# Altium project SSST.PrjPcb
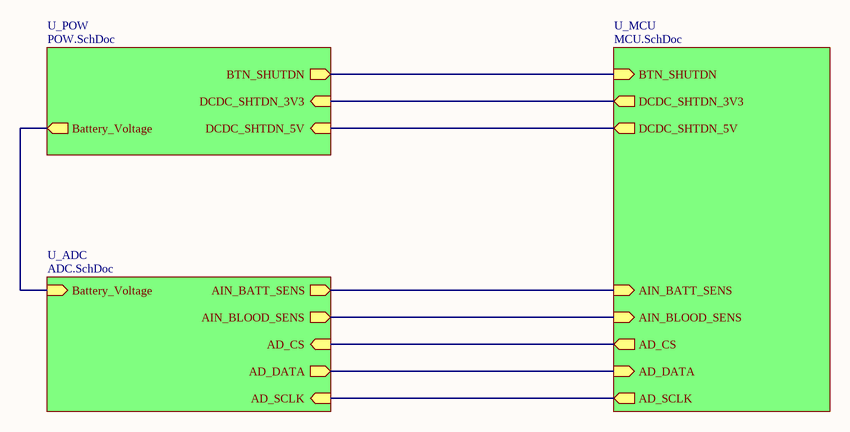
[diagram p0: TOP.SchDoc]
4 sheets, 72 parts. Net scope: hierarchical (ports join the sheet entries above them; power ports are global).
Board files: 4Layer_Imposition.PcbDoc, 4Layer.PcbDoc
Sheets:
  TOP.SchDoc
    U_ADC = ADC.SchDoc
    U_MCU = MCU.SchDoc
    U_POW = POW.SchDoc

## Sheet TOP.SchDoc
size A4; DocumentNumber: 1; SheetNumber: 1; SheetTotal: 4

### Sub-sheets
U_ADC = ADC.SchDoc: AIN_BLOOD_SENS (out), AD_CS (in), AD_DATA (out), AD_SCLK (in), Battery_Voltage (in), AIN_BATT_SENS (out)
U_MCU = MCU.SchDoc: BTN_SHUTDN (in), AIN_BLOOD_SENS (in), AD_CS (out), AD_DATA (in), AD_SCLK (out), DCDC_SHTDN_3V3 (out), DCDC_SHTDN_5V (out), AIN_BATT_SENS (in)
U_POW = POW.SchDoc: DCDC_SHTDN_3V3 (in), DCDC_SHTDN_5V (in), BTN_SHUTDN (out), Battery_Voltage (out)

### Nets
AIN_BLOOD_SENS: sheet U_ADC/AIN_BLOOD_SENS, sheet U_MCU/AIN_BLOOD_SENS
NetC2_2: sheet U_MCU/BTN_SHUTDN, sheet U_POW/BTN_SHUTDN
NetC7_2: sheet U_ADC/Battery_Voltage, sheet U_POW/Battery_Voltage
NetD1_A: sheet U_MCU/DCDC_SHTDN_3V3, sheet U_POW/DCDC_SHTDN_3V3
NetR6_2: sheet U_MCU/DCDC_SHTDN_5V, sheet U_POW/DCDC_SHTDN_5V
NetU4_16: sheet U_ADC/AIN_BATT_SENS, sheet U_MCU/AIN_BATT_SENS
NetU4_50: sheet U_ADC/AD_DATA, sheet U_MCU/AD_DATA
NetU4_51: sheet U_ADC/AD_CS, sheet U_MCU/AD_CS
NetU4_52: sheet U_ADC/AD_SCLK, sheet U_MCU/AD_SCLK

### Notes on the sheet
- Project Title:
- Project No:
- Size:
- Date:
- A4
- Rev:
- Page Title:
- Sheet:
- of

## Sheet ADC.SchDoc
size A4; DocumentNumber: 3; SheetNumber: 3; SheetTotal: 4
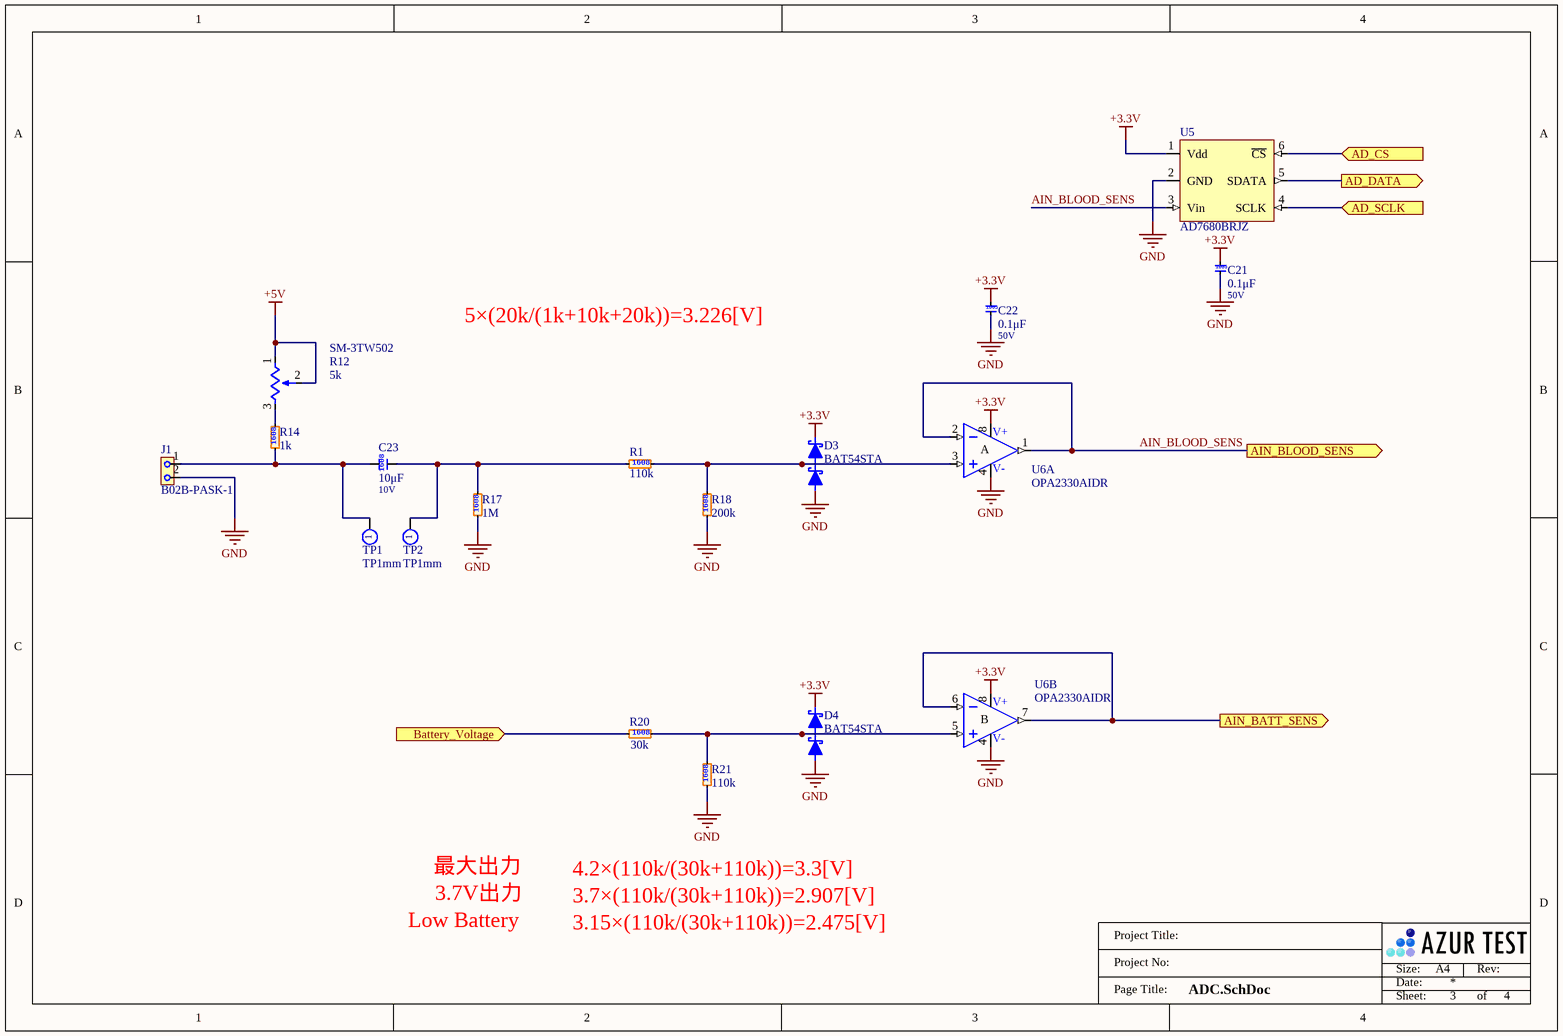
[diagram p1: ADC.SchDoc]

### Parts
C21  Tag: 0.1μF  Voltage: 50V  [C1005]  (hidden comment: GRM1552C1H101J)
C22  Tag: 0.1μF  Voltage: 50V  [C1005]  (hidden comment: GRM1552C1H101J)
C23  Tag: 10μF  Voltage: 10V  [C1608]  (hidden comment: C1608X5R1A106M080AC)
D3  BAT54STA  [SOT-23]
D4  BAT54STA  [SOT-23]
J1  B02B-PASK-1  [B02B-PASK-1]
R1  Tag: 110k  [R1608]  (hidden comment: RG1608P-114-B-T5)
R12  SM-3TW502  Tag: 5k  [SM-3TW]
R14  Tag: 1k  [R1608]  (hidden comment: RG1608P-102-B-T5)
R17  Tag: 1M  [R1608]  (hidden comment: RT0603DRD071ML)
R18  Tag: 200k  [R1608]  (hidden comment: RG1608P-204-B-T5)
R20  Tag: 30k  [R1608]  (hidden comment: RG1608P-303-B-T5)
R21  Tag: 110k  [R1608]  (hidden comment: RG1608P-114-B-T5)
TP1  TP1mm  [TP1mm]  (no BOM)
TP2  TP1mm  [TP1mm]  (no BOM)
U5  AD7680BRJZ  [SOT-23-6]
U6  OPA2330AIDR  [SOIC8_3.9mm]  (parts A,B of 2)

### Ports
AD_CS (in), AD_DATA (out), AD_SCLK (in), AIN_BATT_SENS (out), AIN_BLOOD_SENS (out), Battery_Voltage (in)

### Nets
+3.3V: C21.2 C22.2 D3.2(K) D4.2(K) U5.1(Vdd) U6.8(V+)
+5V: R12.1 R12.2
GND: C21.1 C22.1 D3.1(A) D4.1(A) J1.2 R17.1 R18.1 R21.1 U5.2(GND) U6.4(V-)
AIN_BLOOD_SENS: U5.3(Vin) U6.1(OUT) U6.2(IN-) ; port AIN_BLOOD_SENS
NetC7_2: R20.1 ; port Battery_Voltage
NetC23_1: C23.1 R1.1 R17.2 TP2.1
NetC23_2: C23.2 J1.1 R14.1 TP1.1
NetD3_3: D3.3(C) R1.2 R18.2 U6.3(IN+)
NetD4_3: D4.3(C) R20.2 R21.2 U6.5(IN+)
NetR12_3: R12.3 R14.2
NetU4_16: U6.6(IN-) U6.7(OUT) ; port AIN_BATT_SENS
NetU4_50: U5.5(SDATA) ; port AD_DATA
NetU4_51: U5.6(~{CS}) ; port AD_CS
NetU4_52: U5.4(SCLK) ; port AD_SCLK

### Notes on the sheet
- 5×(20k/(1k+10k+20k))=3.226[V]
- 最大出力
- 3.7V出力
- 4.2×(110k/(30k+110k))=3.3[V]
- 3.7×(110k/(30k+110k))=2.907[V]
- Low Battery
- 3.15×(110k/(30k+110k))=2.475[V]
- Project Title:
- Project No:
- Size:
- Date:
- A4
- Rev:
- Page Title:
- Sheet:
- of
- (in symbol C1005) 1005
- (in symbol C1608) 1608
- (in symbol MF1608) 1608
- (in symbol OPA2330AIDR, part A) A
- (in symbol OPA2330AIDR, part B) B

### Library data of the parts
C21 C22 = C1005: セラコン1005サイズ; Vendor: murata
C23 = C1608: セラコン1608サイズ; Vendor: TDK Corporation
D3 D4 = BAT54S: ダブル直列ショットキー; Vendor: Fairchild
J1 = B02B-PASK-1: 雄,ストレート,1列2ピン; Vendor: JST
R1 R14 R18 R20 R21 = MF1608: 薄膜チップ抵抗1608サイズ; Vendor: susumu
R12 = SM-3TW***: CERMET TRIMMER 11 turns Top adjustmet; Vendor: Copal
R17 = MF1608: 薄膜チップ抵抗1608サイズ; Vendor: Yageo
TP1 TP2 = TP1mm: Test-Point 1mm
U5 = AD7680BRJZ: 16bit ADC 2.5V～5.5V SOT23; Vender: Analog Devices
U6 = OPA2330AIDR: CMOS ゼロドリフトアンプ 2回路 レールツーレール 8SOIC; Vendor: Texas Instruments

## Sheet MCU.SchDoc
size A4; DocumentNumber: 4; SheetNumber: 4; SheetTotal: 4
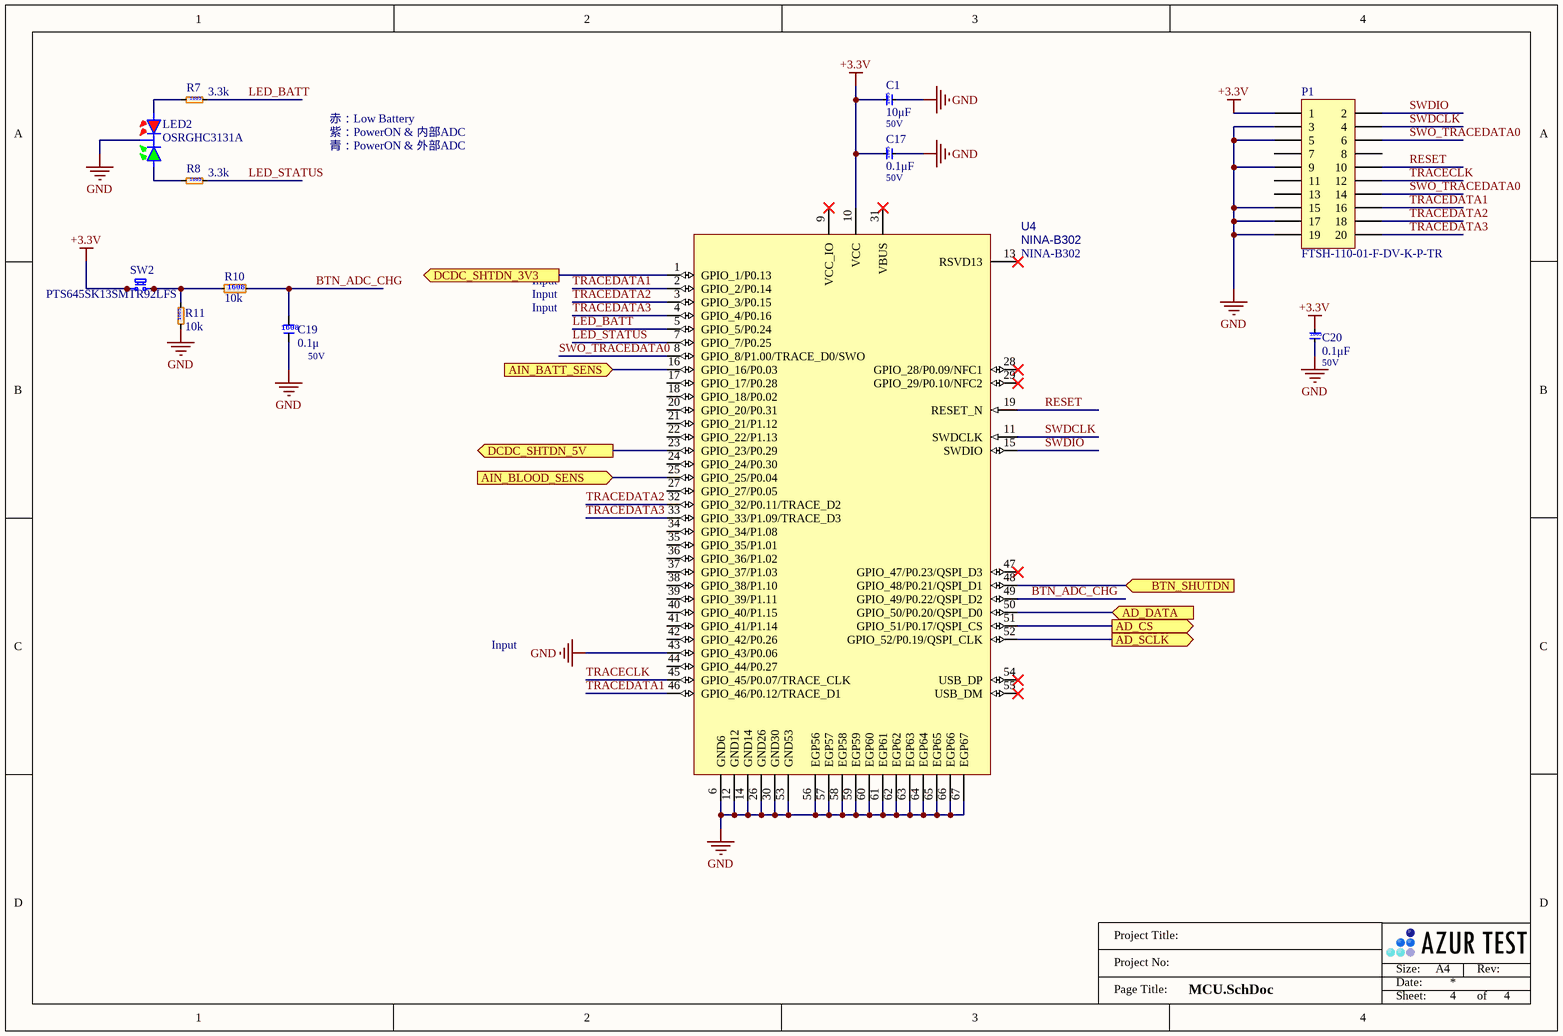
[diagram p2: MCU.SchDoc]

### Parts
C1  Tag: 10μF  Voltage: 50V  [C1005]  (hidden comment: GRM155F11H103Z)
C17  Tag: 0.1μF  Voltage: 50V  [C1005]  (hidden comment: GRM1552C1H101J)
C19  Tag: 0.1μ  Voltage: 50V  [C1608]  (hidden comment: GRM1885C1H101JA01D)
C20  Tag: 0.1μF  Voltage: 50V  [C1005]  (hidden comment: GRM1552C1H101J)
LED2  OSRGHC3131A  [LED3COLORS]
P1  FTSH-110-01-F-DV-K-P-TR  [Headerpin 2x10]
R7  Tag: 3.3k  [R1005]  (hidden comment: RG1005P-332-B-T5)
R8  Tag: 3.3k  [R1005]  (hidden comment: RG1005P-332-B-T5)
R10  Tag: 10k  [R1608]  (hidden comment: RG1608P-103-B-T5)
R11  Tag: 10k  [R1005]  (hidden comment: RG1005P-103-B-T5)
SW2  PTS645SK13SMTR92LFS  [PTS645SK13SMTR92LFS]
U4  NINA-B302  [NINA_LGA67R_1500X1000X338_PIFA]

### Ports
AD_CS (out), AD_DATA (in), AD_SCLK (out), AIN_BATT_SENS (in), AIN_BLOOD_SENS (in), BTN_SHUTDN (in), DCDC_SHTDN_3V3 (out), DCDC_SHTDN_5V (out)

### Nets
+3.3V: C1.2 C17.2 C20.2 P1.1 SW2.1 SW2.2 U4.10(VCC)
GND: C1.1 C17.1 C19.1 C20.1 LED2.2(K) P1.3 P1.5 P1.9 P1.15 P1.17 P1.19 R11.1 U4.6(GND6) U4.12(GND12) U4.14(GND14) U4.26(GND26) U4.30(GND30) U4.43(GPIO_43/P0.06) U4.53(GND53) U4.56(EGP56) U4.57(EGP57) U4.58(EGP58) U4.59(EGP59) U4.60(EGP60) U4.61(EGP61) U4.62(EGP62) U4.63(EGP63) U4.64(EGP64) U4.65(EGP65) U4.66(EGP66) U4.67(EGP67)
AIN_BLOOD_SENS: U4.25(GPIO_25/P0.04) ; port AIN_BLOOD_SENS
BTN_ADC_CHG: C19.2 R10.2 U4.49(GPIO_49/P0.22/QSPI_D2)
LED_BATT: R7.2 U4.5(GPIO_5/P0.24)
LED_STATUS: R8.2 U4.7(GPIO_7/P0.25)
RESET: P1.10 U4.19(RESET_N)
SWDCLK: P1.4 U4.11(SWDCLK)
SWDIO: P1.2 U4.15(SWDIO)
SWO_TRACEDATA0: P1.6 P1.14 U4.8(GPIO_8/P1.00/TRACE_D0/SWO)
TRACECLK: P1.12 U4.45(GPIO_45/P0.07/TRACE_CLK)
TRACEDATA1: P1.16 U4.2(GPIO_2/P0.14) U4.46(GPIO_46/P0.12/TRACE_D1)
TRACEDATA2: P1.18 U4.3(GPIO_3/P0.15) U4.32(GPIO_32/P0.11/TRACE_D2)
TRACEDATA3: P1.20 U4.4(GPIO_4/P0.16) U4.33(GPIO_33/P1.09/TRACE_D3)
NetC2_2: U4.48(GPIO_48/P0.21/QSPI_D1) ; port BTN_SHUTDN
NetD1_A: U4.1(GPIO_1/P0.13) ; port DCDC_SHTDN_3V3
NetLED2_1: LED2.1(A) R8.1
NetLED2_3: LED2.3(C) R7.1
NetR6_2: U4.23(GPIO_23/P0.29) ; port DCDC_SHTDN_5V
NetR10_1: R10.1 R11.2 SW2.3 SW2.4
NetU4_16: U4.16(GPIO_16/P0.03) ; port AIN_BATT_SENS
NetU4_50: U4.50(GPIO_50/P0.20/QSPI_D0) ; port AD_DATA
NetU4_51: U4.51(GPIO_51/P0.17/QSPI_CS) ; port AD_CS
NetU4_52: U4.52(GPIO_52/P0.19/QSPI_CLK) ; port AD_SCLK

Not connected (* = marked no-connect by the designer): P1 7 8 11 13; U4 9(VCC_IO)* 13(RSVD13)* 17(GPIO_17/P0.28) 18(GPIO_18/P0.02) 20(GPIO_20/P0.31) 21(GPIO_21/P1.12) 22(GPIO_22/P1.13) 24(GPIO_24/P0.30) 27(GPIO_27/P0.05) 28(GPIO_28/P0.09/NFC1)* 29(GPIO_29/P0.10/NFC2)* 31(VBUS)* 34(GPIO_34/P1.08) 35(GPIO_35/P1.01) 36(GPIO_36/P1.02) 37(GPIO_37/P1.03) 38(GPIO_38/P1.10) 39(GPIO_39/P1.11) 40(GPIO_40/P1.15) 41(GPIO_41/P1.14) 42(GPIO_42/P0.26) 44(GPIO_44/P0.27) 47(GPIO_47/P0.23/QSPI_D3)* 54(USB_DP)* 55(USB_DM)*

### Notes on the sheet
- 赤：Low Battery
- 紫：PowerON & 内部ADC
- 青：PowerON & 外部ADC
- Input
- Project Title:
- Project No:
- Size:
- Date:
- A4
- Rev:
- Page Title:
- Sheet:
- of
- (in symbol C1005) 1005
- (in symbol C1608) 1608
- (in symbol MF1005) 1005
- (in symbol MF1608) 1608

### Library data of the parts
C1 C17 C20 = C1005: セラコン1005サイズ; Vendor: murata
C19 = C1608: セラコン1608サイズ; Vendor: murata
LED2 = OSRGHC3131A: 2色LED（赤,青）; Vendor: AKIZUKI
P1 = FTSH-110-01-F-DV-K-P-TR: Header, 2 x 10 -Pin 1.27mm
R7 R8 R11 = MF1005: 薄膜チップ抵抗1005サイズ; Vendor: susumu
R10 = MF1608: 薄膜チップ抵抗1608サイズ; Vendor: susumu
SW2 = PTS645SK13SMTR92LFS: Tactile Switch 6 x 6mm; Vendor: C&K
U4 = NINA-B302: u-blox NINA-B302 Bluetooth 5 LE, 802.15.4 module; Part Description: Stand-alone Bluetooth low energy module; Manufacturer: u-blox; Value: NINA-B302

## Sheet POW.SchDoc
size A4; DocumentNumber: 2; SheetNumber: 2; SheetTotal: 4
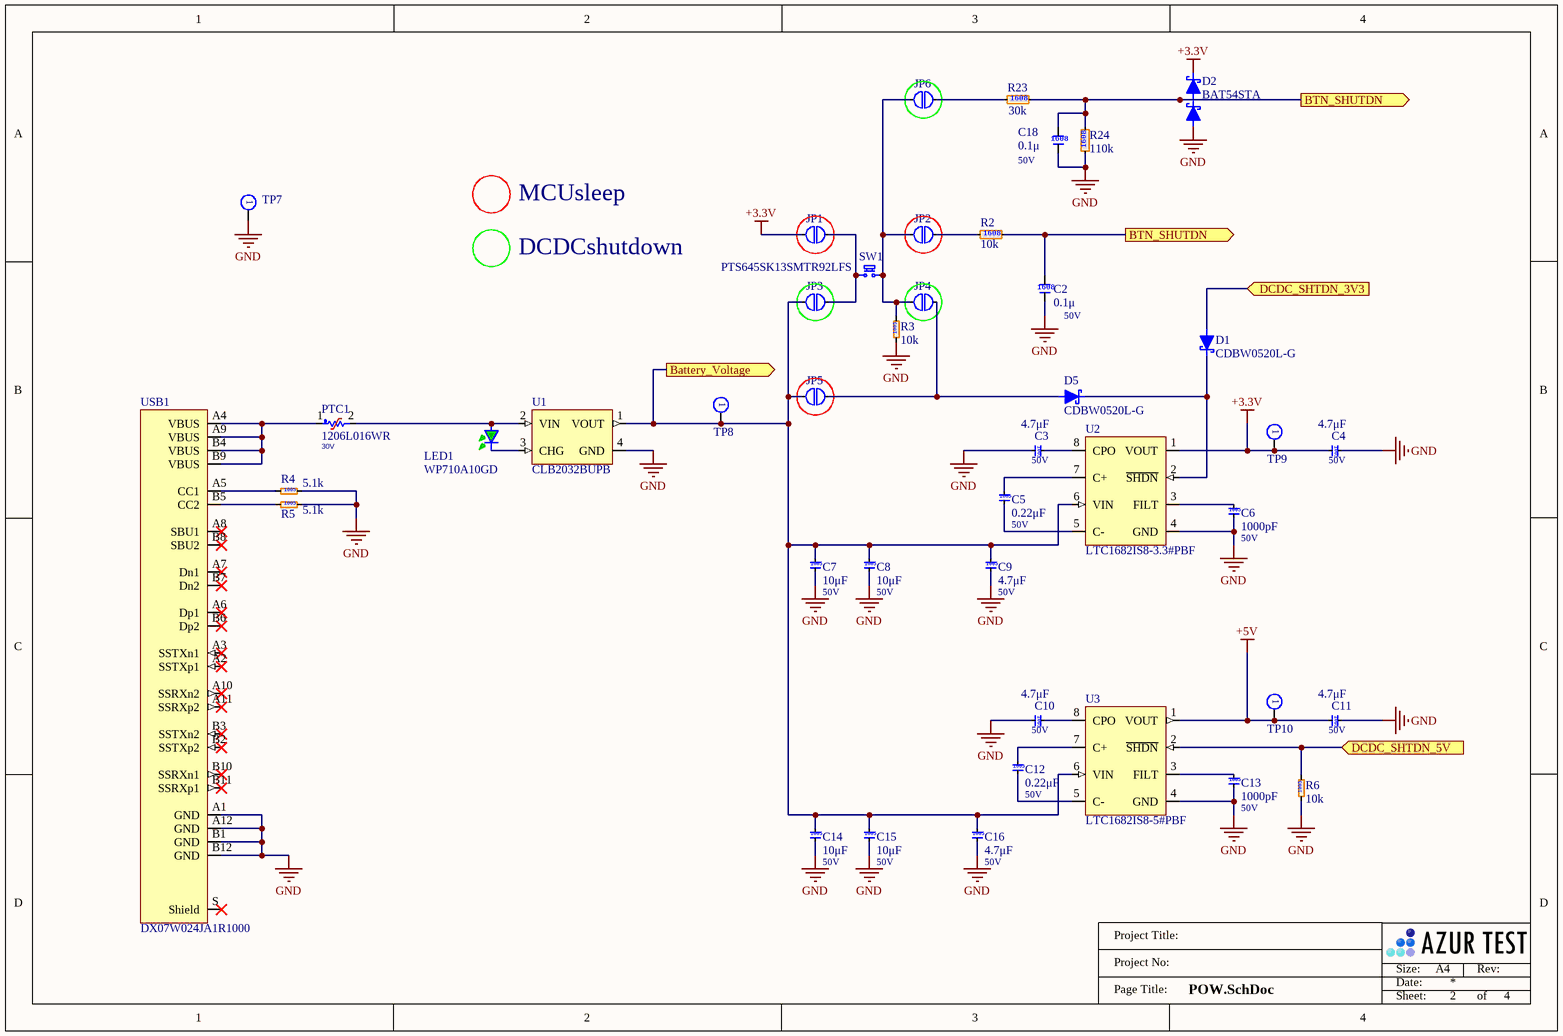
[diagram p3: POW.SchDoc]

### Parts
C2  Tag: 0.1μ  Voltage: 50V  [C1608]  (hidden comment: GRM1885C1H101JA01D)
C3  Tag: 4.7μF  Voltage: 50V  [C1005]  (hidden comment: GRM155B11H472K)
C4  Tag: 4.7μF  Voltage: 50V  [C1005]  (hidden comment: GRM155B11H472K)
C5  Tag: 0.22μF  Voltage: 50V  [C1005]  (hidden comment: GRM1552C1H221J)
C6  Tag: 1000pF  Voltage: 50V  [C1005]  (hidden comment: GRM1552C1H102J)
C7  Tag: 10μF  Voltage: 50V  [C1005]  (hidden comment: GRM155F11H103Z)
C8  Tag: 10μF  Voltage: 50V  [C1005]  (hidden comment: GRM155F11H103Z)
C9  Tag: 4.7μF  Voltage: 50V  [C1005]  (hidden comment: GRM155B11H472K)
C10  Tag: 4.7μF  Voltage: 50V  [C1005]  (hidden comment: GRM155B11H472K)
C11  Tag: 4.7μF  Voltage: 50V  [C1005]  (hidden comment: GRM155B11H472K)
C12  Tag: 0.22μF  Voltage: 50V  [C1005]  (hidden comment: GRM1552C1H221J)
C13  Tag: 1000pF  Voltage: 50V  [C1005]  (hidden comment: GRM1552C1H102J)
C14  Tag: 10μF  Voltage: 50V  [C1005]  (hidden comment: GRM155F11H103Z)
C15  Tag: 10μF  Voltage: 50V  [C1005]  (hidden comment: GRM155F11H103Z)
C16  Tag: 4.7μF  Voltage: 50V  [C1005]  (hidden comment: GRM155B11H472K)
C18  Tag: 0.1μ  Voltage: 50V  [C1608]  (hidden comment: GRM1885C1H101JA01D)
D1  CDBW0520L-G  [SOD-123]
D2  BAT54STA  [SOT-23]
D5  CDBW0520L-G  [SOD-123]
JP1  SMD_JAMPER  [SMD_JAMPER]  (value not drawn)  (no BOM)
JP2  SMD_JAMPER  [SMD_JAMPER]  (value not drawn)  (no BOM)
JP3  SMD_JAMPER  [SMD_JAMPER]  (value not drawn)  (no BOM)
JP4  SMD_JAMPER  [SMD_JAMPER]  (value not drawn)  (no BOM)
JP5  SMD_JAMPER  [SMD_JAMPER]  (value not drawn)  (no BOM)
JP6  SMD_JAMPER  [SMD_JAMPER]  (value not drawn)  (no BOM)
LED1  WP710A10GD  [LED_T1]
PTC1  1206L016WR  Voltage: 30V  [1206L]
R2  Tag: 10k  [R1608]  (hidden comment: RG1608P-103-B-T5)
R3  Tag: 10k  [R1005]  (hidden comment: RG1005P-103-B-T5)
R4  Tag: 5.1k  [R1005]  (hidden comment: RG1005P-512-B-T5)
R5  Tag: 5.1k  [R1005]  (hidden comment: RG1005P-512-B-T5)
R6  Tag: 10k  [R1005]  (hidden comment: RG1005P-103-B-T5)
R23  Tag: 30k  [R1608]  (hidden comment: RG1608P-303-B-T5)
R24  Tag: 110k  [R1608]  (hidden comment: RG1608P-114-B-T5)
SW1  PTS645SK13SMTR92LFS  [PTS645SK13SMTR92LFS]
TP7  TP1mm  [TP1mm]  (value not drawn)  (no BOM)
TP8  TP1mm  [TP1mm]  (value not drawn)  (no BOM)
TP9  TP1mm  [TP1mm]  (value not drawn)  (no BOM)
TP10  TP1mm  [TP1mm]  (value not drawn)  (no BOM)
U1  CLB2032BUPB  [CLB2032BUPB]
U2  LTC1682IS8-3.3#PBF  [SOIC8_3.9mm]
U3  LTC1682IS8-5#PBF  [SOIC8_3.9mm]
USB1  DX07W024JA1R1000  [DX07W024JA1R1000]

### Ports
Battery_Voltage (out), BTN_SHUTDN (out), DCDC_SHTDN_3V3 (in), DCDC_SHTDN_5V (in)

### Nets
+3.3V: C4.1 D2.2(K) JP1.1 TP9.1 U2.1(VOUT)
+5V: C11.1 TP10.1 U3.1(VOUT)
GND: C2.1 C3.1 C4.2 C6.1 C7.1 C8.1 C9.1 C10.1 C11.2 C13.1 C14.1 C15.1 C16.1 C18.1 D2.1(A) R3.1 R4.2 R5.2 R6.1 R24.1 TP7.1 U1.4(GND) U2.4(GND) U3.4(GND) USB1.A1(GND) USB1.A12(GND) USB1.B1(GND) USB1.B12(GND)
NetC2_2: C2.2 C18.2 D2.3(C) R2.2 R23.2 R24.2 ; port BTN_SHUTDN
NetC3_2: C3.2 U2.8(CPO)
NetC5_1: C5.1 U2.5(C-)
NetC5_2: C5.2 U2.7(C+)
NetC6_2: C6.2 U2.3(FILT)
NetC7_2: C7.2 C8.2 C9.2 C14.2 C15.2 C16.2 JP3.1 JP5.1 TP8.1 U1.1(VOUT) U2.6(VIN) U3.6(VIN) ; port Battery_Voltage
NetC10_2: C10.2 U3.8(CPO)
NetC12_1: C12.1 U3.5(C-)
NetC12_2: C12.2 U3.7(C+)
NetC13_2: C13.2 U3.3(FILT)
NetD1_A: D1.A ; port DCDC_SHTDN_3V3
NetD1_K: D1.K D5.K U2.2(~{SHDN})
NetD5_A: D5.A JP4.2 JP5.2
NetJP1_2: JP1.2 JP3.2 SW1.1 SW1.2
NetJP2_1: JP2.1 JP4.1 JP6.1 R3.2 SW1.3 SW1.4
NetJP2_2: JP2.2 R2.1
NetJP6_2: JP6.2 R23.1
NetLED1_A: LED1.A PTC1.2 U1.2(VIN)
NetLED1_K: LED1.K U1.3(CHG)
NetPTC1_1: PTC1.1 USB1.A4(VBUS) USB1.A9(VBUS) USB1.B4(VBUS) USB1.B9(VBUS)
NetR4_1: R4.1 USB1.A5(CC1)
NetR5_1: R5.1 USB1.B5(CC2)
NetR6_2: R6.2 U3.2(~{SHDN}) ; port DCDC_SHTDN_5V

Not connected (* = marked no-connect by the designer): USB1 A2(SSTXp1)* A3(SSTXn1)* A6(Dp1)* A7(Dn1)* A8(SBU1)* A10(SSRXn2)* A11(SSRXp2)* B2(SSTXp2)* B3(SSTXn2)* B6(Dp2)* B7(Dn2)* B8(SBU2)* B10(SSRXn1)* B11(SSRXp1)* S(Shield)*

### Notes on the sheet
- MCUsleep
- DCDCshutdown
- Project Title:
- Project No:
- Size:
- Date:
- A4
- Rev:
- Page Title:
- Sheet:
- of
- (in symbol C1005) 1005
- (in symbol C1608) 1608
- (in symbol MF1005) 1005
- (in symbol MF1608) 1608

### Library data of the parts
C2 C18 = C1608: セラコン1608サイズ; Vendor: murata
C3-C16 = C1005: セラコン1005サイズ; Vendor: murata
D1 D5 = CDBW0520L-G: Schottky Rectifier; Vendor: Comchip Technology; Voltage: 20V; Current: 500mA
D2 = BAT54S: ダブル直列ショットキー; Vendor: Fairchild
LED1 = WP710A10GD: LED T1 GREEN; Vendor: Kingbright; Color: Green
PTC1 = 1206L: Resettable PTC; Vendor: Littelfuse; Trip_Current: *; Hold_Current: *
R2 R23 R24 = MF1608: 薄膜チップ抵抗1608サイズ; Vendor: susumu
R3-R6 = MF1005: 薄膜チップ抵抗1005サイズ; Vendor: susumu
SW1 = PTS645SK13SMTR92LFS: Tactile Switch 6 x 6mm; Vendor: C&K
TP7-TP10 = TP1mm: Test-Point 1mm
U1 = CLB2032BUPB: CLB電池ユニット　ピンタイプ
U2 = LTC1682IS8-3.3#PBF: IC REG CHARGE PUMP 3.3V 8SOIC
U3 = LTC1682IS8-5#PBF: IC REG CHARGE PUMP 5V MSOP8
USB1 = DX07W024JA1R1000: USB3.1 Type-C; Vendor: JAE

## Nets that join several sheets
+3.3V: ADC (6 pins), MCU (7 pins), POW (5 pins)
+5V: ADC (R12.1 R12.2), POW (C11.1 TP10.1 U3.1)
GND: ADC (10 pins), MCU (31 pins), POW (28 pins)
AIN_BLOOD_SENS: ADC (U5.3 U6.1 U6.2), MCU (U4.25)
NetC2_2: MCU (U4.48), POW (6 pins)
NetC7_2: ADC (R20.1), POW (12 pins)
NetD1_A: MCU (U4.1), POW (D1.A)
NetR6_2: MCU (U4.23), POW (R6.2 U3.2)
NetU4_16: ADC (U6.6 U6.7), MCU (U4.16)
NetU4_50: ADC (U5.5), MCU (U4.50)
NetU4_51: ADC (U5.6), MCU (U4.51)
NetU4_52: ADC (U5.4), MCU (U4.52)